# EAGLE design MODULO_TECLADO (EAGLE 7.5.0)
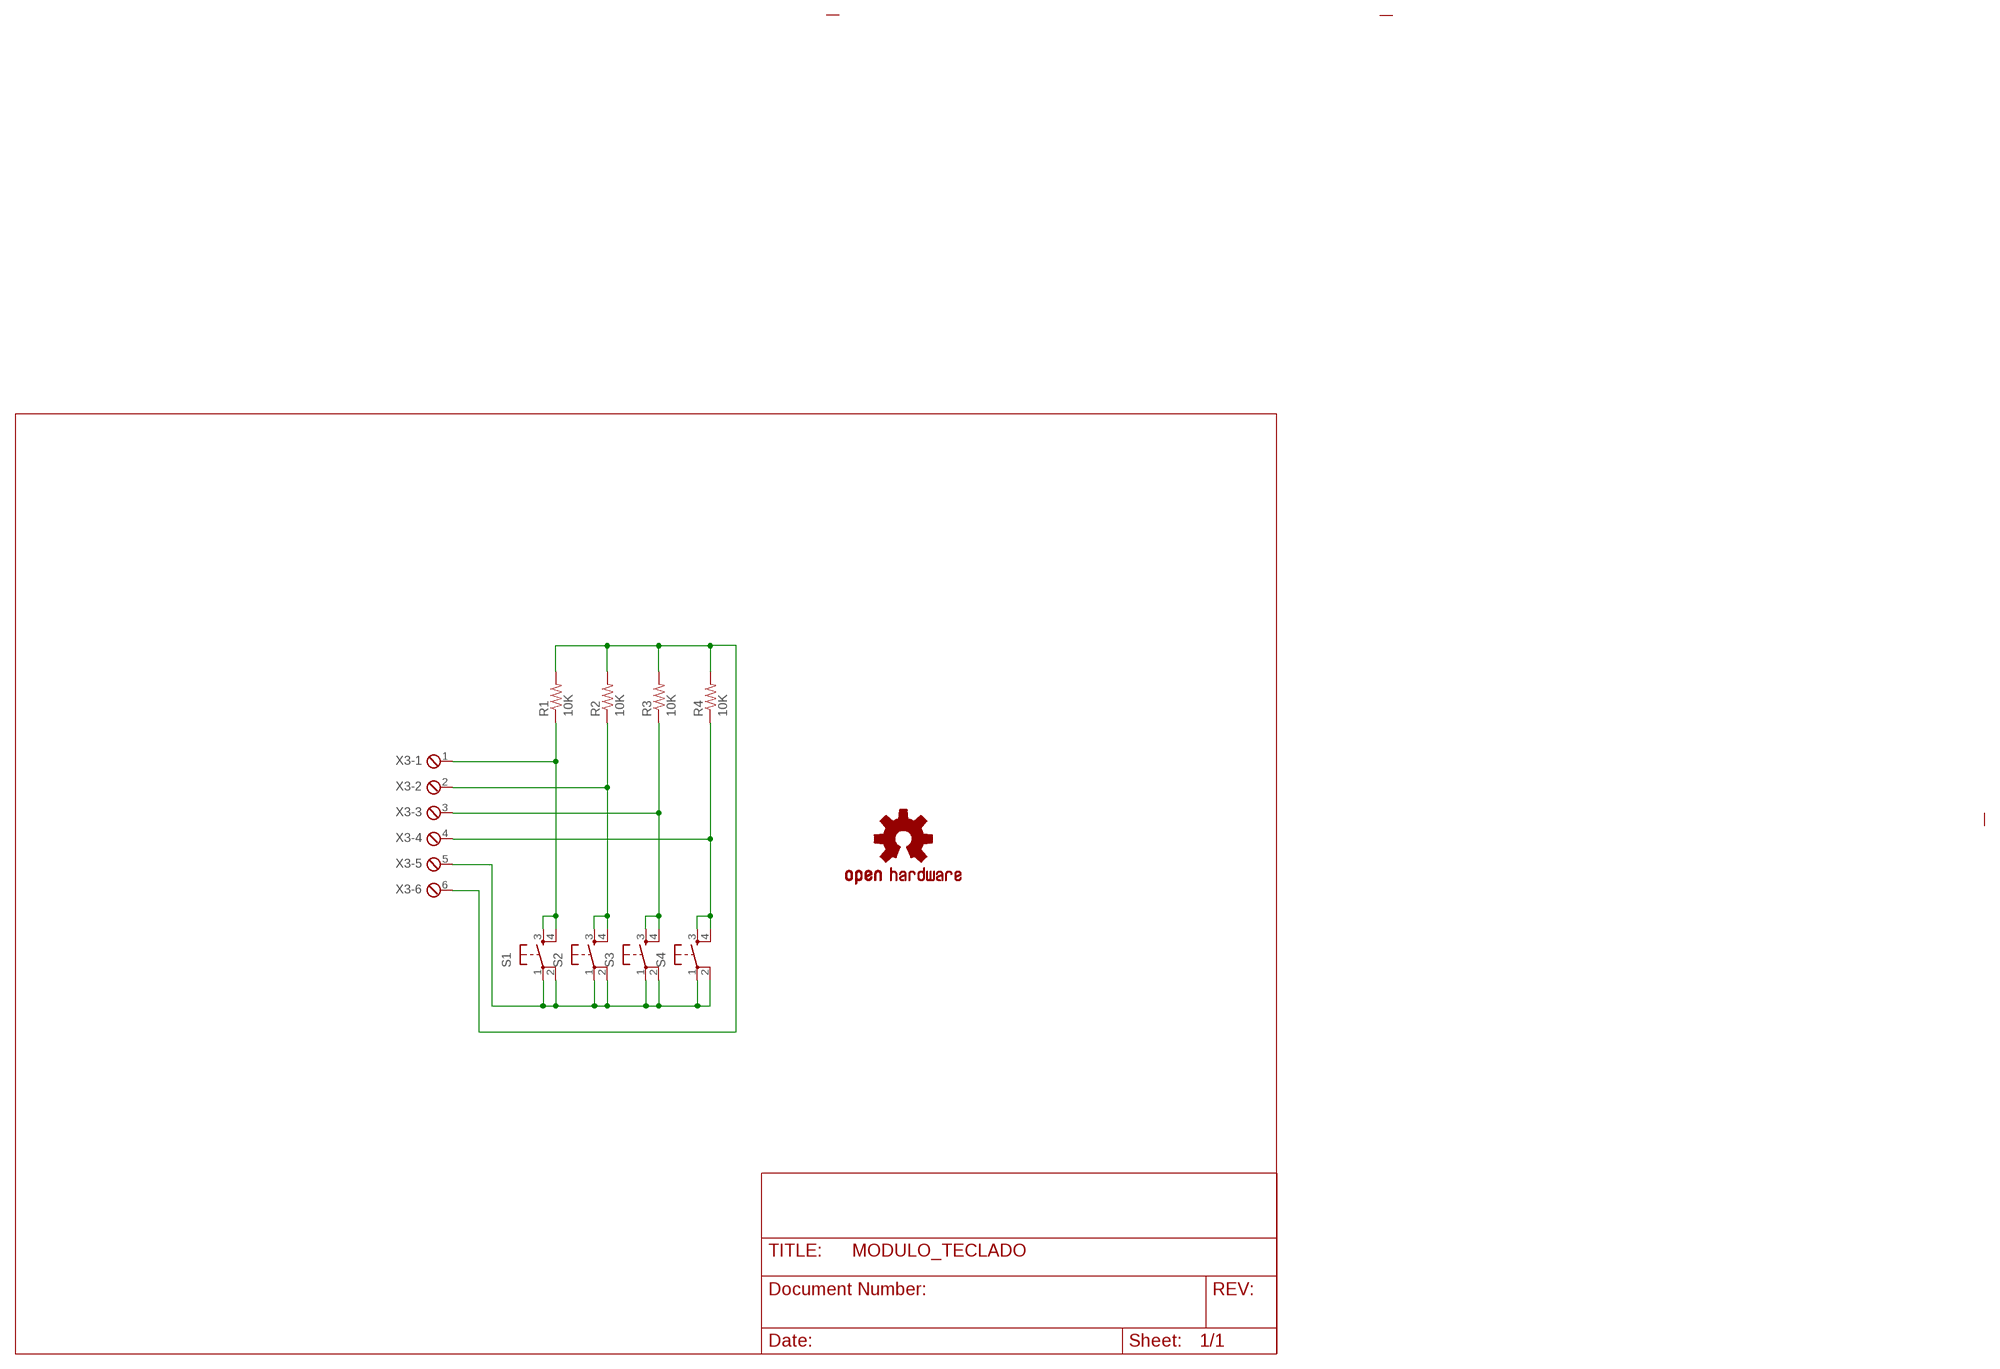
[diagram p0: schematic, sheet 1]

## Parts
LOGO1  OSHW-LOGOM  [OSHW-LOGO-M]
R1  10K  RESISTORPTH-1/4W  [AXIAL-0.4]
R2  10K  RESISTORPTH-1/4W  [AXIAL-0.4]
R3  10K  RESISTORPTH-1/4W  [AXIAL-0.4]
R4  10K  RESISTORPTH-1/4W  [AXIAL-0.4]
S1  TAC_SWITCHPTH  [TACTILE-PTH]
S2  TAC_SWITCHPTH  [TACTILE-PTH]
S3  TAC_SWITCHPTH  [TACTILE-PTH]
S4  TAC_SWITCHPTH  [TACTILE-PTH]
X3  MPT6  [6POL254]

## Nets
N$1: R1.P$1 S1.3 S1.4 X3.1
N$2: R2.P$1 S2.3 S2.4 X3.2
N$3: R3.P$1 S3.3 S3.4 X3.3
N$4: R4.P$1 S4.3 S4.4 X3.4
N$9: S1.1 S1.2 S2.1 S2.2 S3.1 S3.2 S4.1 S4.2 X3.5
N$10: R1.P$2 R2.P$2 R3.P$2 R4.P$2 X3.6

## Library data of the parts
LOGO1 = SparkFun-Aesthetics:OSHW-LOGO: Open Source Hardware Logo This logo indicates the piece of hardware it is found on incorporates a OSHW license and/or adheres to the definition of open source hardware found here: http://freedomdefined.org/OSHW
R1-R4 = SparkFun:RESISTOR: Resistor Basic schematic elements and footprints for 0603, 1206, and PTH resistors.
S1-S4 = SparkFun:TAC_SWITCH: Momentary Switch Button commonly used for reset or general input. Spark Fun Electronics SKU : COM-00097
X3 = con-phoenix-254:MPT6: PHOENIX CONNECTOR; OC_FARNELL: unknown; OC_NEWARK: unknown

## Board
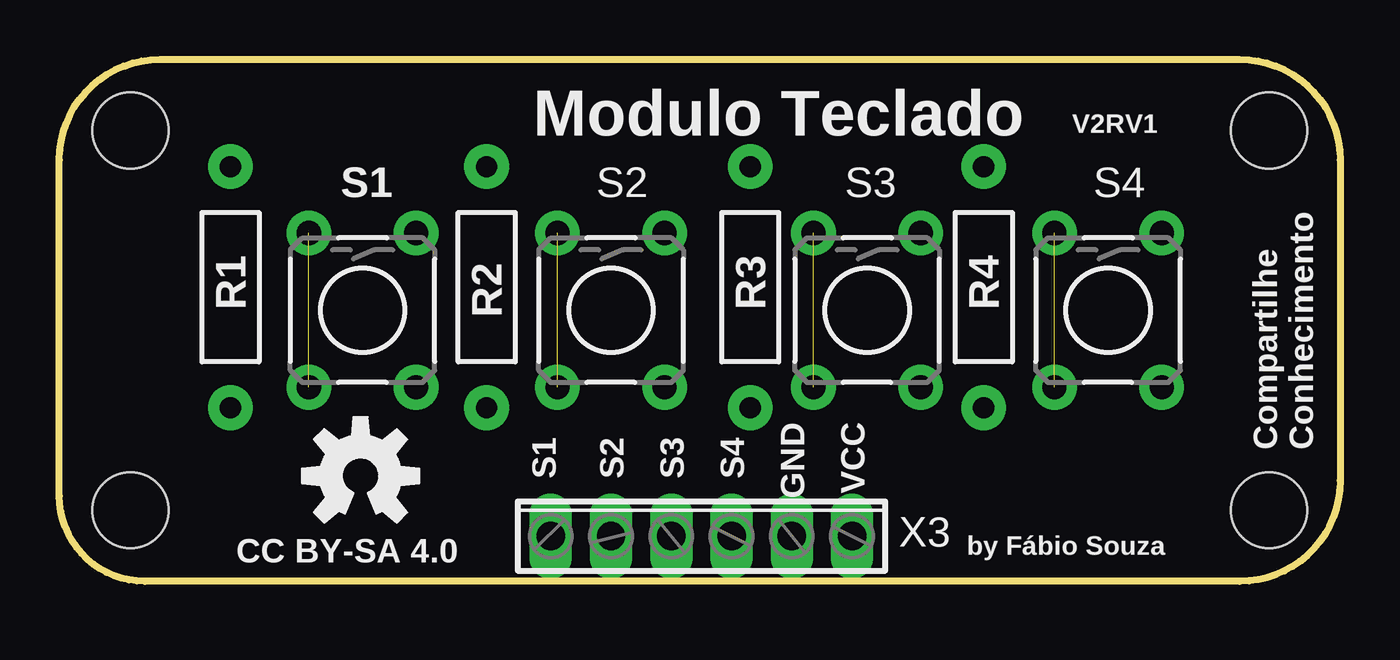
[diagram p1: board, top side]
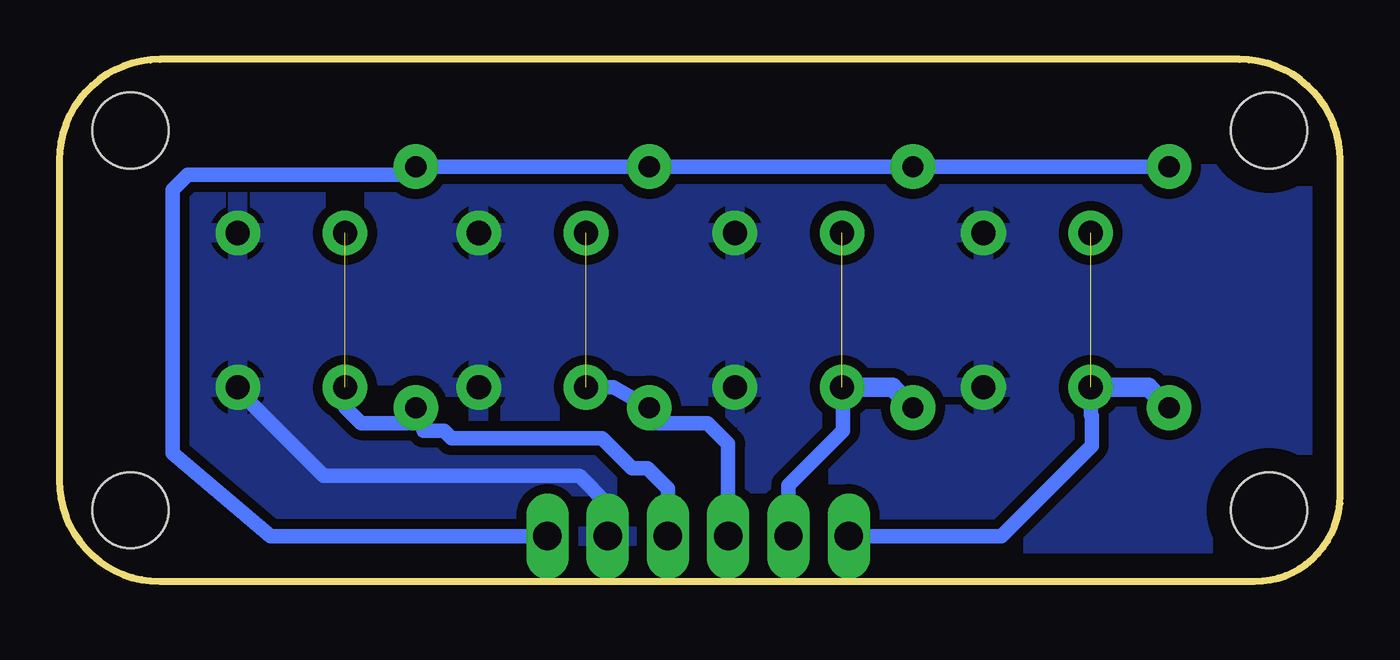
[diagram p2: board, bottom side, seen from below]

Size 54 x 22 mm. Coordinates in mm from the lower left corner, seen from the top.
Outline: 4.24,22 49.76,22 arc-90 54,17.76 54,4.24 arc-90 49.76,0 3.61,0 arc-90 0,3.61 0,17.76 arc-90 4.24,22
Copper layers (1*16): Top 0.035mm / dielectric 1.5mm / Bottom 0.035mm
Design rules "default": minimum track width 10mil, minimum drill 24mil, track to track 8mil, track to pad 8mil, pad to pad 8mil, via to via 8mil, smd to smd 8mil, copper to edge 40mil, drill to drill 8mil, minimum pad ring 10mil, minimum via ring 8mil, stop-mask expansion 4mil, vias tented up to drill 0mil, thermal gap 10mil
Holes 3.2 mm at 3,19 3,3 51,3 51,19

### Footprints (pad centres in the part's own frame; a part is rotated, then mirrored left to right if it is on the bottom)
AXIAL-0.4 = drill 0.9 pad 1.88: P$1 -5.08,0; P$2 5.08,0
TACTILE-PTH = drill 1.016 pad 1.88: 1 -3.251,2.261; 2 3.251,2.261; 3 -3.251,-2.261; 4 3.251,-2.261
6POL254 = drill 1.2 pad 1.778 long: 1 -6.35,0; 2 -3.81,0; 3 -1.27,0; 4 1.27,0; 5 3.81,0; 6 6.35,0

### Placement (x,y rotation side)
LOGO1  12.7,4.45 0 top
R1  7.22,12.4 90 top
R2  18.02,12.4 90 top
R3  29.13,12.4 90 top
R4  38.97,12.4 90 top
S1  12.78,11.43 270 top
S2  23.26,11.43 270 top
S3  34.05,11.43 270 top
S4  44.22,11.43 270 top
X3  27.07,1.91 0 top

### Tracks (layer width: path | path; a pad name or v marks a point on that pad's centre or on a via)
N$1  (1 unrouted)
  Bottom 0.61: 10.48,8.13 S1.4 10.52,7.03 10.48,6.99 10.48,5.71 14.29,1.91 X3.1
  Bottom 0.813: S1.4 8.08,8.18 R1.P$1
N$2  (1 unrouted)
  Bottom 0.61: X3.2 23.26,4.04 20.95,6.35 20.95,8.13 S2.4
  Bottom 0.813: S2.4 18.88,8.18 R2.P$1
N$3  (1 unrouted)
  Bottom 0.61: S3.4 30.63,8.18 R3.P$1 29.11,6.67 26.67,6.67 25.8,5.8 X3.3
N$4  (1 unrouted)
  Bottom 0.61: S4.4 41.95,7.35 41.27,6.67 38.98,6.67 R4.P$1 38.64,6.35 37.78,6.35 37.47,6.03 31.11,6.03 29.84,4.76 29.21,4.76 28.34,3.89 X3.4
N$9
  Bottom 0.61: X3.5 30.88,3.26 32.07,4.45 42.86,4.45 46.67,8.26
  pour Bottom (isolate 0.406): 0.4,0 0.4,21.27 53.42,21.27 53.42,0
N$10
  Bottom 0.61: X3.6 45.09,1.91 49.21,5.4 49.21,16.51 48.58,17.14 39.27,17.14 R4.P$2 R3.P$2 R2.P$2 R1.P$2

### Text on the board
tNames: Modulo Teclado | V2RV1 | GND | VCC | S1 | S2 | S3 | S4 | Compartilhe / Conhecimento | CC BY-SA 4.0 | by Fábio Souza